# Altium schematic sheet POS3V3.SchDoc
size B
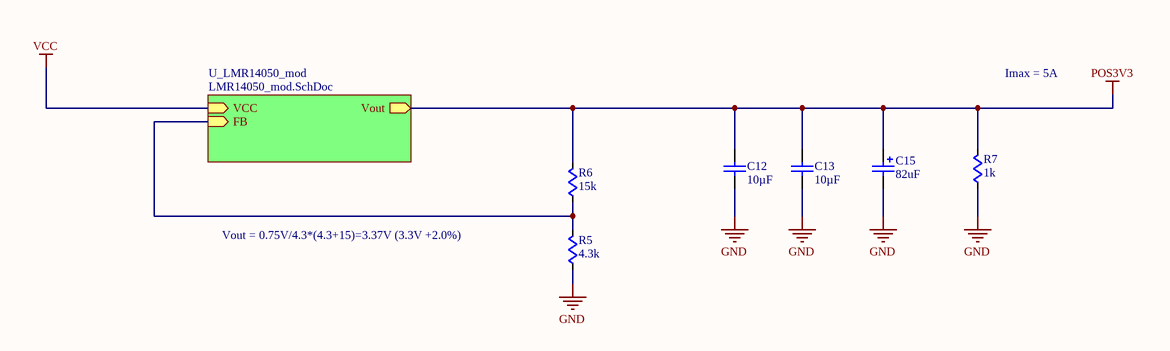
[diagram p0: POS3V3.SchDoc]

## Parts
C12  value 10µF  [C0805]  (hidden comment: Cap)
C13  value 10µF  [C0805]  (hidden comment: Cap)
C15  value 82uF  [CAP_EEFK_D8]  (hidden comment: EEEFK1V680XP)
R5  value 4.3k  [R0805]  (hidden comment: Res)
R6  value 15k  [R0805]  (hidden comment: Res)
R7  value 1k  [R0805]  (hidden comment: Res)

## Sub-sheets
U_LMR14050_mod = LMR14050_mod.SchDoc: VCC (in), FB (in), Vout (out)

## Nets
GND: C12.1 C13.1 C15.2 R5.1 R7.1
POS3V3: C12.2 C13.2 C15.1 R6.2 R7.2 ; sheet U_LMR14050_mod/Vout
VCC: sheet U_LMR14050_mod/VCC
NetR5_2: R5.2 R6.1 ; sheet U_LMR14050_mod/FB

## Notes on the sheet
- Imax = 5A
- Vout = 0.75V/4.3*(4.3+15)=3.37V (3.3V +2.0%)

## Library data of the parts
C12 C13 = Cap: capacitor
C15 = EEEFK1V680XP: Polarized Capacitor (Surface Mount); Vendor: Panasonic; Built_By: EMA_UL_Team; C: Copyright (C) 2015 Accelerated Designs. All rights reserved; Manufacturer_Part_Number: EEEFK1V680XP; Supplier 1: Digi-Key; Supplier Part Number 1: P18960DKR-ND
R5-R7 = Res: resistor